# Altium schematic sheet MB1297_NFC_SAFE.SchDoc: NFC & STSAFE
size A4; Date: Not used; ApprovedBy: Not used; CheckedBy: Not used; Author: Not used; CompanyName: STMicroelectronics; DrawnBy: Not used; Engineer: Not used; Organization: Not used; Address1: Not used; Address2: Not used; Address3: Not used; Address4: Not used; DocumentNumber: Not used; Revision: Not used; SheetNumber: 8; SheetTotal: 12; CurrentTime: Not used; CurrentDate: Not used; Time: Not used; DocumentFullPathAndName: Not used; DocumentName: Not used; ModifiedDate: Not used; ImagePath: Not used; ProjectName: Not used; Application_BuildNumber: Not used
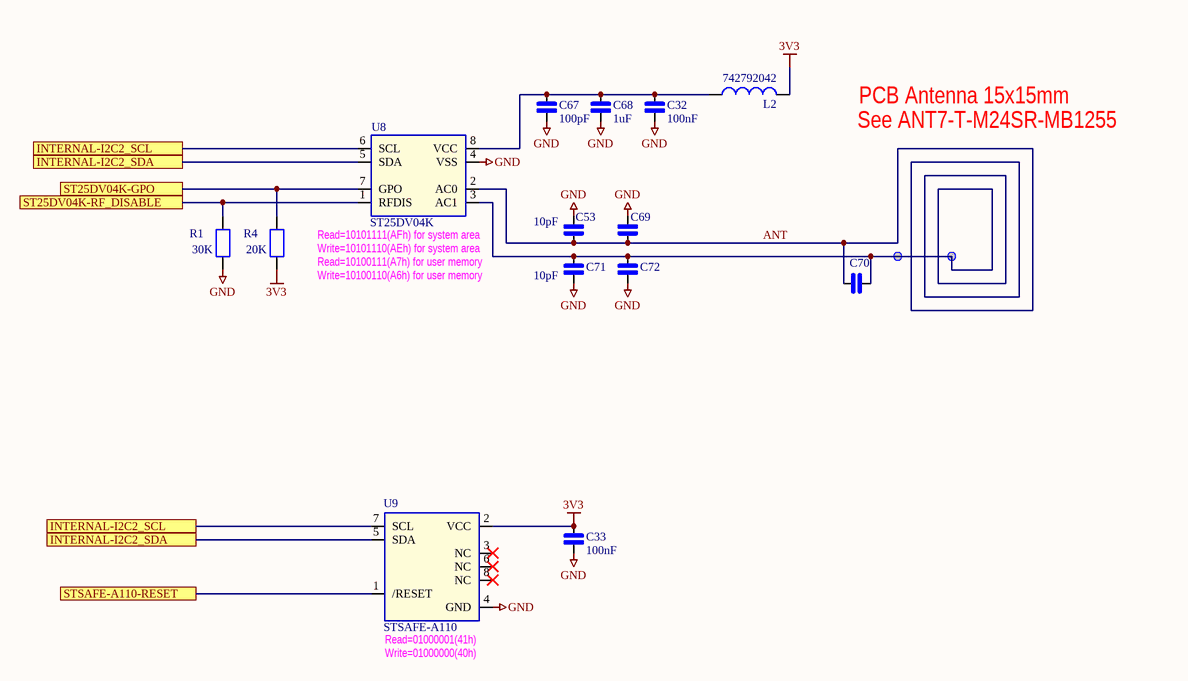
[diagram p0: MB1297_NFC_SAFE.SchDoc]

## Parts
C32  100nF  [0402]
C33  100nF  [0402]
C53  10pF  [0402]
C67  100pF  [0402]
C68  1uF  [0402]
C69  (no value)  [0402]
C70  (no value)  [0402]
C71  10pF  [0402]
C72  (no value)  [0402]
L2  742792042  [0603L]
R1  30K  [0402]
R4  20K  [0402]
U8  ST25DV04K  [SOP8]
U9  STSAFE-A110  [SOP8]

## Ports
INTERNAL-I2C2_SCL, INTERNAL-I2C2_SDA, ST25DV04K-GPO, ST25DV04K-RF_DISABLE, STSAFE-A110-RESET

## Nets
3V3: C33.1 L2.2 R4.1 U9.2(VCC)
GND: C32.2 C33.2 C53.2 C67.2 C68.2 C69.2 C71.2 C72.2 R1.1 U8.4(VSS) U9.4(GND)
ANT: C53.1 C69.1 C70.1 C70.2 C71.1 C72.1 U8.2(AC0) U8.3(AC1)
INTERNAL-I2C2_SCL: U8.6(SCL) U9.7(SCL) ; port INTERNAL-I2C2_SCL
INTERNAL-I2C2_SDA: U8.5(SDA) U9.5(SDA) ; port INTERNAL-I2C2_SDA
ST25DV04K-GPO: R4.2 U8.7(GPO) ; port ST25DV04K-GPO
ST25DV04K-RF_DISABLE: R1.2 U8.1(RFDIS) ; port ST25DV04K-RF_DISABLE
STSAFE-A110-RESET: U9.1(/RESET) ; port STSAFE-A110-RESET
NetC32_1: C32.1 C67.1 C68.1 L2.1 U8.8(VCC)

Not connected (* = marked no-connect by the designer): U9 3(NC)* 6(NC)* 8(NC)*

## Notes on the sheet
- PCB Antenna 15x15mm
- See ANT7-T-M24SR-MB1255
- Read=10101111(AFh) for system area
- Write=10101110(AEh) for system area
- Read=10100111(A7h) for user memory
- Write=10100110(A6h) for user memory
- (near U9) Read=01000001(41h)
- (near U9) Write=01000000(40h)
- Title:
- Project:
- Size:
- Revision:
- Variant:
- A4
- -
- Date:
- Reference:
- Sheet:
- of

## Library data of the parts
C32 C33 C53 C67-C72 = CAP_NPOL: Capacitor_not polarized
L2 = Inductor: Value: 100uH; Published: 8-Jun-2000; Revision: July-2002: Re-released for DXP Platform.; Publisher: Altium Limited
R1 R4 = RES: Resistor
U8 = M24SR64-Y: ST25DV04K 64K_EEPROM NFC/RFID
U9 = STSAFE-A100